# EAGLE design video_and_power (EAGLE 7.7.0)
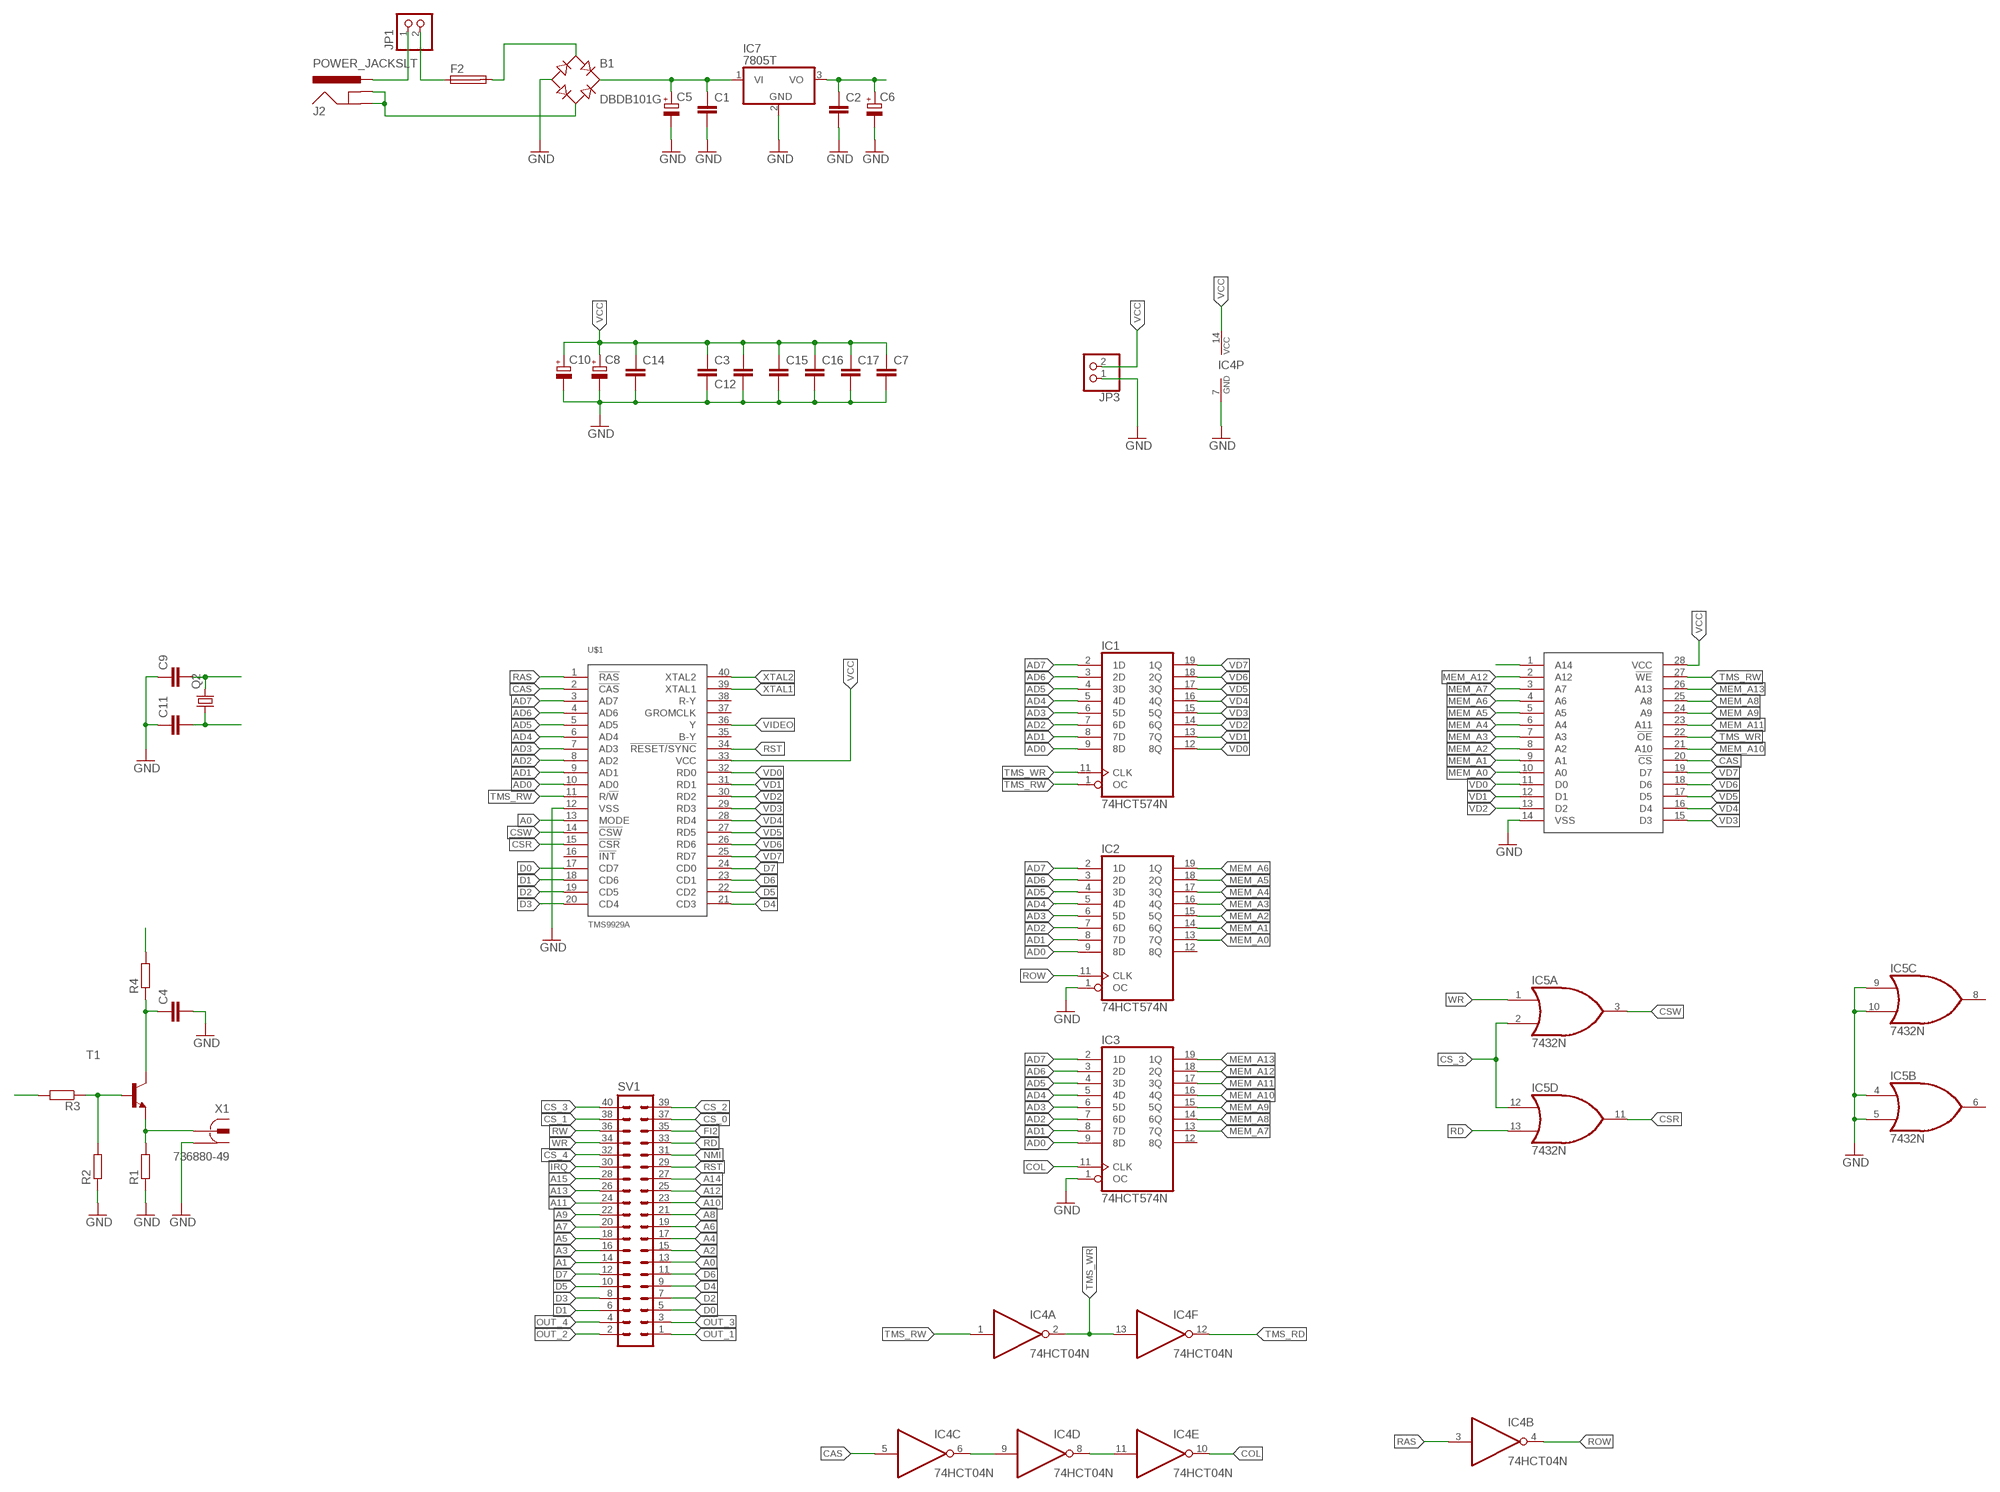
[diagram p0: schematic, sheet 1]

## Parts
B1  DBDB101G  [DB]
C1  C-EUC1206  [C1206]
C2  C-EUC1206  [C1206]
C3  C-EUC0603  [C0603]
C4  C-EUC0603  [C0603]
C5  CPOL-EUE5-10.5  [E5-10,5]
C6  CPOL-EUE5-10.5  [E5-10,5]
C7  C-EUC1206  [C1206]
C8  CPOL-EUE5-10.5  [E5-10,5]
C9  C-EUC0603  [C0603]
C10  CPOL-EUE5-10.5  [E5-10,5]
C11  C-EUC0603  [C0603]
C12  C-EUC0603  [C0603]
C14  C-EUC1206  [C1206]
C15  C-EUC1206  [C1206]
C16  C-EUC0603  [C0603]
C17  C-EUC0603  [C0603]
F2  SH22,5  [SH22,5]
IC1  74HCT574N  [DIL20]
IC2  74HCT574N  [DIL20]
IC3  74HCT574N  [DIL20]
IC4  74HCT04N  [DIL14]
IC5  7432N  [DIL14]
IC7  7805T  [TO220H]
J2  POWER_JACKSLT  [POWER_JACK_SLOT]
JP1  PINHD-1X2  [1X02]
JP3  PINHD-1X2/90  [1X02/90]
Q2  CRYSTALHC49S  [HC49/S]
R1  R-EU_R0603  [R0603]
R2  R-EU_R0603  [R0603]
R3  R-EU_0204/7  [0204/7]
R4  R-EU_R0805  [R0805]
SV1  ML40L  [ML40L]
T1  2N4401-NPN-TO92-EBC  [TO92-EBC]
U$1  TMS9929A  [DIL40]
U$2  62256  [DIL28-6]
X1  736880-49  [736880-49]

## Nets
A0: SV1.13 U$1.13(MODE)
A1: SV1.14
A2: SV1.15
A3: SV1.16
A4: SV1.17
A5: SV1.18
A6: SV1.19
A7: SV1.20
A8: SV1.21
A9: SV1.22
A10: SV1.23
A11: SV1.24
A12: SV1.25
A13: SV1.26
A14: SV1.27
A15: SV1.28
AD0: IC1.9(8D) IC2.9(8D) IC3.9(8D) U$1.10(AD0)
AD1: IC1.8(7D) IC2.8(7D) IC3.8(7D) U$1.9(AD1)
AD2: IC1.7(6D) IC2.7(6D) IC3.7(6D) U$1.8(AD2)
AD3: IC1.6(5D) IC2.6(5D) IC3.6(5D) U$1.7(AD3)
AD4: IC1.5(4D) IC2.5(4D) IC3.5(4D) U$1.6(AD4)
AD5: IC1.4(3D) IC2.4(3D) IC3.4(3D) U$1.5(AD5)
AD6: IC1.3(2D) IC2.3(2D) IC3.3(2D) U$1.4(AD6)
AD7: IC1.2(1D) IC2.2(1D) IC3.2(1D) U$1.3(AD7)
CAS: IC4.5(C:I) U$1.2(!CAS) U$2.20(!CS)
COL: IC3.11(CLK) IC4.10(E:O)
CS_0: SV1.37
CS_1: SV1.38
CS_2: SV1.39
CS_3: IC5.2(A:I1) IC5.12(D:I0) SV1.40
CS_4: SV1.32
CSR: IC5.11(D:O) U$1.15(!CSR)
CSW: IC5.3(A:O) U$1.14(!CSW)
D0: SV1.5 U$1.17(CD7)
D1: SV1.6 U$1.18(CD6)
D2: SV1.7 U$1.19(CD5)
D3: SV1.8 U$1.20(CD4)
D4: SV1.9 U$1.21(CD3)
D5: SV1.10 U$1.22(CD2)
D6: SV1.11 U$1.23(CD1)
D7: SV1.12 U$1.24(CD0)
FI2: SV1.35
GND: B1.- C1.2 C2.2 C3.2 C4.2 C5.- C6.- C7.2 C8.- C9.1 C10.- C11.1 C12.1 C14.2 C15.2 C16.2 C17.2 IC2.1(OC) IC3.1(OC) IC4.7(P:GND) IC5.4(B:I0) IC5.5(B:I1) IC5.9(C:I0) IC5.10(C:I1) IC7.2(GND) JP3.1 R1.1 R2.1 U$1.12(VSS) U$2.14(VSS) X1.1 X1.1@1 X1.1@2
IRQ: SV1.30
MEM_A0: IC2.13(7Q) U$2.10(A0)
MEM_A1: IC2.14(6Q) U$2.9(A1)
MEM_A2: IC2.15(5Q) U$2.8(A2)
MEM_A3: IC2.16(4Q) U$2.7(A3)
MEM_A4: IC2.17(3Q) U$2.6(A4)
MEM_A5: IC2.18(2Q) U$2.5(A5)
MEM_A6: IC2.19(1Q) U$2.4(A6)
MEM_A7: IC3.13(7Q) U$2.3(A7)
MEM_A8: IC3.14(6Q) U$2.25(A8)
MEM_A9: IC3.15(5Q) U$2.24(A9)
MEM_A10: IC3.16(4Q) U$2.21(A10)
MEM_A11: IC3.17(3Q) U$2.23(A11)
MEM_A12: IC3.18(2Q) U$2.2(A12)
MEM_A13: IC3.19(1Q) U$2.26(A13)
N$1: IC4.6(C:O) IC4.9(D:I)
N$2: IC4.8(D:O) IC4.11(E:I)
N$3: B1.AC1 F2.2
N$8: J2.PWR JP1.1
N$9: R1.2 T1.E X1.2
N$10: R2.2 R3.1 T1.B
N$11: C4.1 R4.1 T1.C
N$12: B1.AC2 J2.GND@1(GNDBREAK) J2.GND@2(GND)
N$13: F2.1 JP1.2
N$14: B1.+ C1.1 C5.+ IC7.1(VI)
NMI: SV1.31
OUT_1: SV1.1
OUT_2: SV1.2
OUT_3: SV1.3 U$2.1(A14)
OUT_4: SV1.4
RAS: IC4.3(B:I) U$1.1(!RAS)
RD: IC5.13(D:I1) SV1.33
ROW: IC2.11(CLK) IC4.4(B:O)
RST: SV1.29 U$1.34(!RESET/SYNC)
RW: SV1.36
TMS_RD: IC4.12(F:O)
TMS_RW: IC1.1(OC) IC4.1(A:I) U$1.11(R/!W) U$2.27(!WE)
TMS_WR: IC1.11(CLK) IC4.2(A:O) IC4.13(F:I) U$2.22(!OE)
VCC: C2.1 C3.1 C6.+ C7.1 C8.+ C10.+ C12.2 C14.1 C15.1 C16.1 C17.1 IC4.14(P:VCC) IC7.3(VO) JP3.2 R4.2 U$1.33(VCC) U$2.28(VCC)
VD0: IC1.12(8Q) U$1.32(RD0) U$2.11(D0)
VD1: IC1.13(7Q) U$1.31(RD1) U$2.12(D1)
VD2: IC1.14(6Q) U$1.30(RD2) U$2.13(D2)
VD3: IC1.15(5Q) U$1.29(RD3) U$2.15(D3)
VD4: IC1.16(4Q) U$1.28(RD4) U$2.16(D4)
VD5: IC1.17(3Q) U$1.27(RD5) U$2.17(D5)
VD6: IC1.18(2Q) U$1.26(RD6) U$2.18(D6)
VD7: IC1.19(1Q) U$1.25(RD7) U$2.19(D7)
VIDEO: R3.2 U$1.36(Y)
WR: IC5.1(A:I0) SV1.34
XTAL1: C9.2 Q2.2 U$1.39(XTAL1)
XTAL2: C11.2 Q2.1 U$1.40(XTAL2)
Unconnected: IC2.12(8Q) IC3.12(8Q) IC5.6(B:O) IC5.8(C:O) U$1.16(!INT) U$1.35(B-Y) U$1.37(GROMCLK) U$1.38(R-Y)

## Power pins joined to a net without a drawn wire
GND: IC1.10(GND) IC2.10(GND) IC3.10(GND) IC5.7(P:GND)
VCC: IC1.20(VCC) IC2.20(VCC) IC3.20(VCC) IC5.14(P:VCC)

## Library data of the parts
B1 = rectifier:DB?*G: Single Phase 1.0 AMP Glass Passivated Bridge Rectifier Taiwan Semiconductor Co.,Ltd. - TSC Source: http://www.taiwansemi.com/TSCbig5/ezcatfiles/cust/img/img/db101g.pdf http://www.ts.com.tw/db/pictures/modules/PDT/PDT060207001/DBLS201G.pdf
C1-C4 C7 C9 C11 C12 C14-C17 = rcl:C-EU: CAPACITOR, European symbol
C5 C6 C8 C10 = rcl:CPOL-EU: POLARIZED CAPACITOR, European symbol
F2 = fuse:SH22,5: FUSE HOLDER grid 22,5 mm, OGN0031 8201, Schurter (Buerklin); MF: SCHURTER; MPN: 0031.8201; OC_FARNELL: 1162740; OC_NEWARK: 96F8317
IC1-IC3 = 74xx-eu:74*574: 8-bit D type FLIP FLOP bus driver
IC4 = 74xx-eu:74*04: Hex INVERTER
IC5 = 74xx-us:74*32: Quad 2-input OR gate
IC7 = linear:78*: Positive VOLTAGE REGULATOR Source: http://cache.national.com/ds/LM/LM78L05.pdf http://www.fairchildsemi.com/ds/LM/LM7805.pdf
J2 = SparkFun-Connectors:POWER_JACK: Power Jack This is the standard 5.5mm barrel jack for power. The PTH is the most common, proven, reliable, footprint. The Slot footprint only works if the mill layer is transmitted to the PCB fab house so be warned. Mating wall wart : TOL-00298 (and others); PROD_ID: PRT-00119
JP1 JP3 = pinhead:PINHD-1X2: PIN HEADER
Q2 = crystal:CRYSTAL: CRYSTAL; OC_FARNELL: 1667008; OC_NEWARK: unknown
R1-R4 = rcl:R-EU_: RESISTOR, European symbol
SV1 = con-harting-ml:ML40: HARTING; OC_FARNELL: unknown; OC_NEWARK: unknown
T1 = transistor-neu-to92:*-NPN-: NPN Transistror
U$1 = mw:TMS9929A
U$2 = memory-sram:62256
X1 = con-conrad:736880-49: Cinch Connector ( RCA Jack ) Cinch-Einbaukupplung 90º 72345 Vernickelt BKL Electronic Source: Conrad <http://www.conrad.de/ce/de/product/736880>

## Board
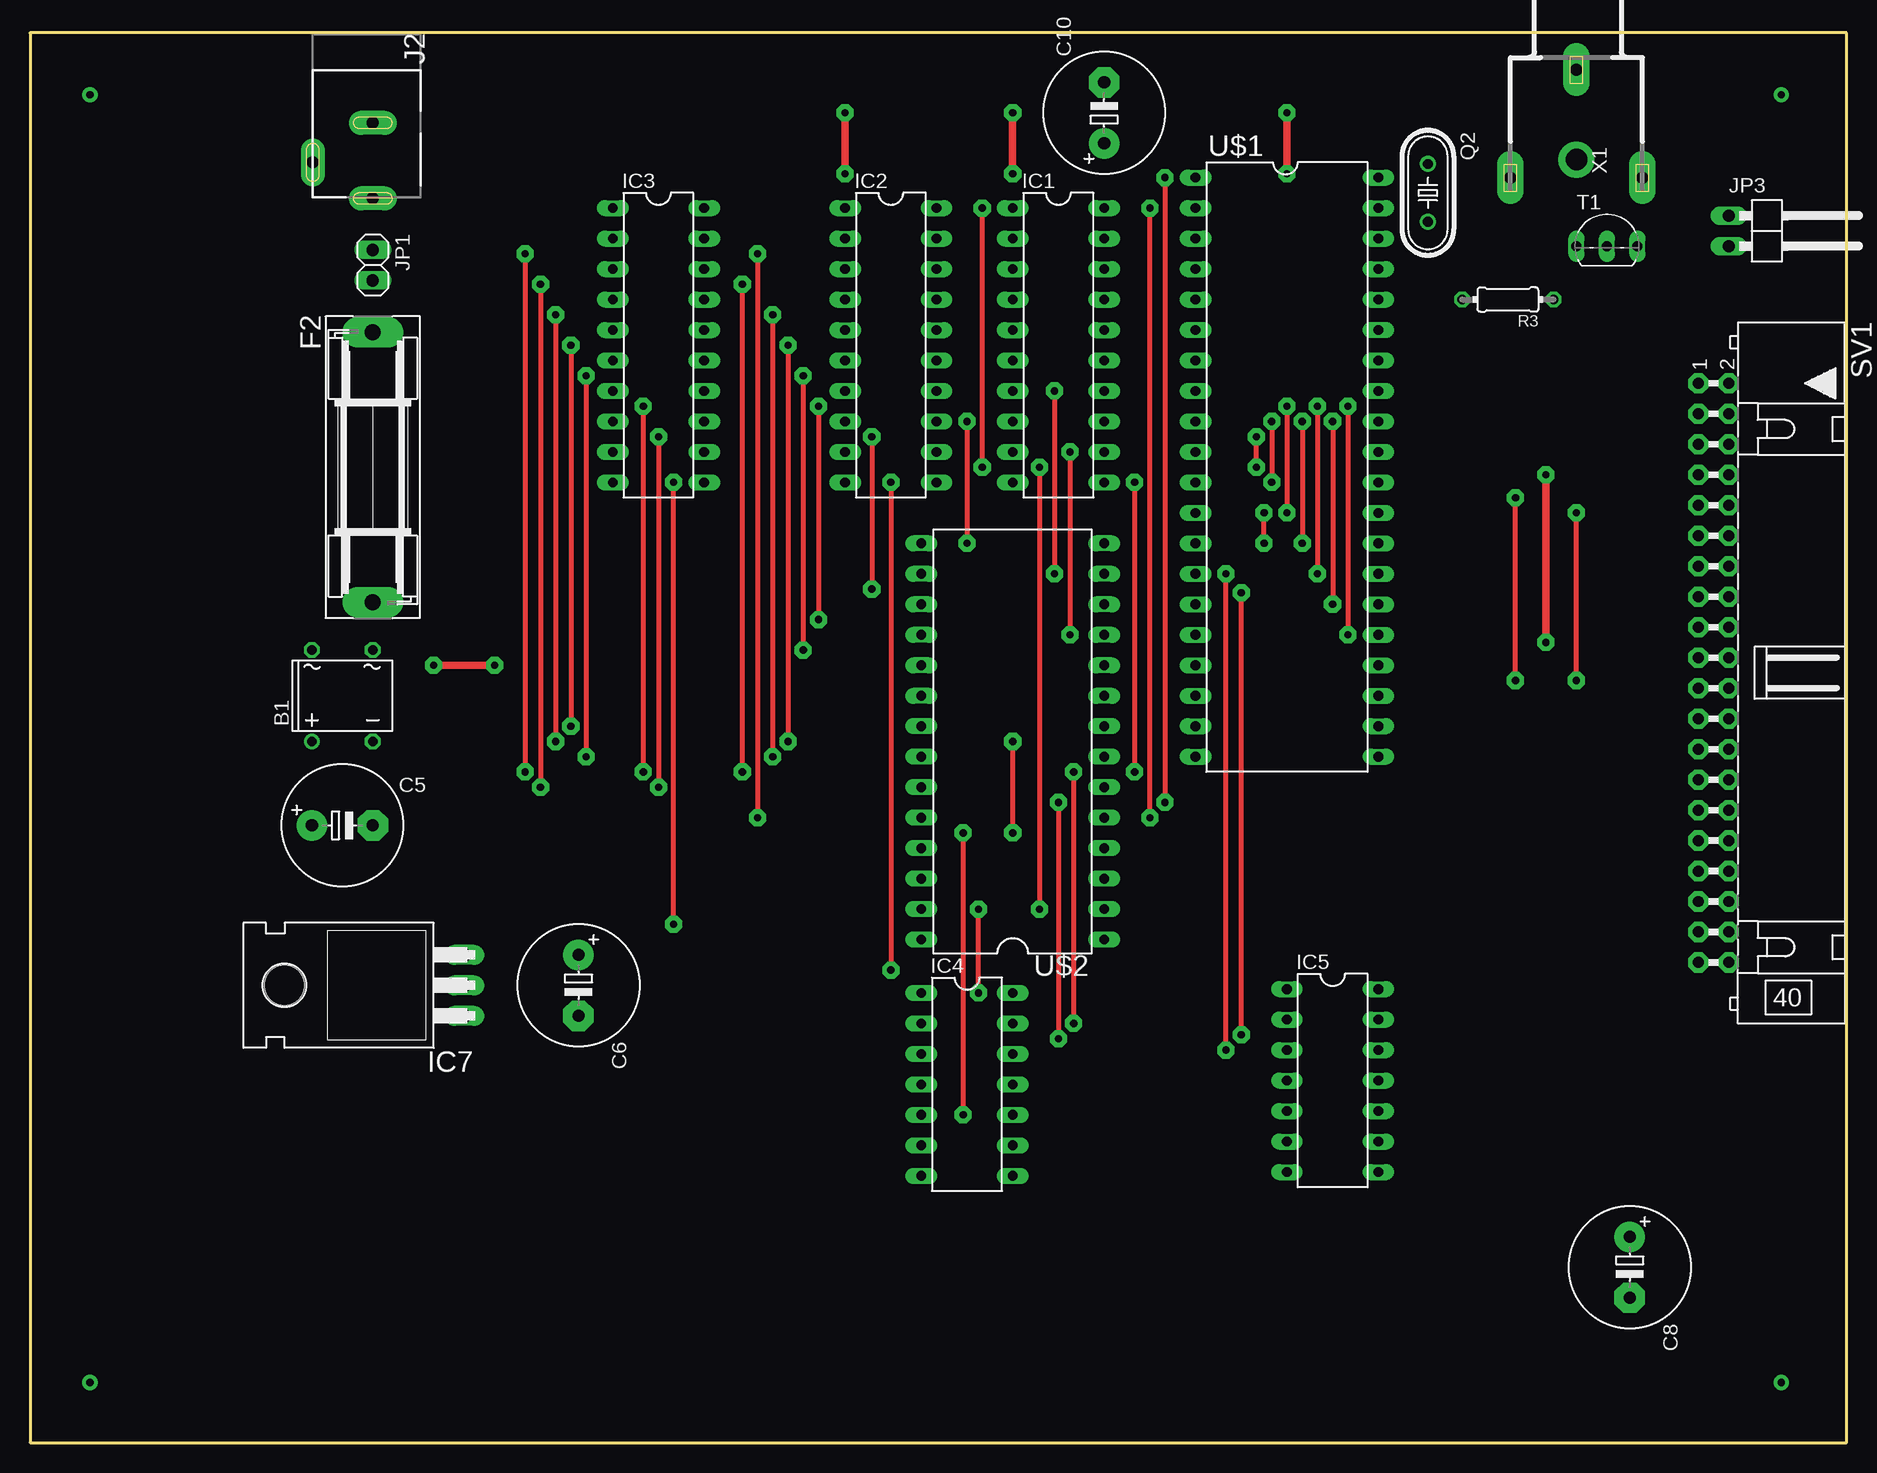
[diagram p1: board, top side]
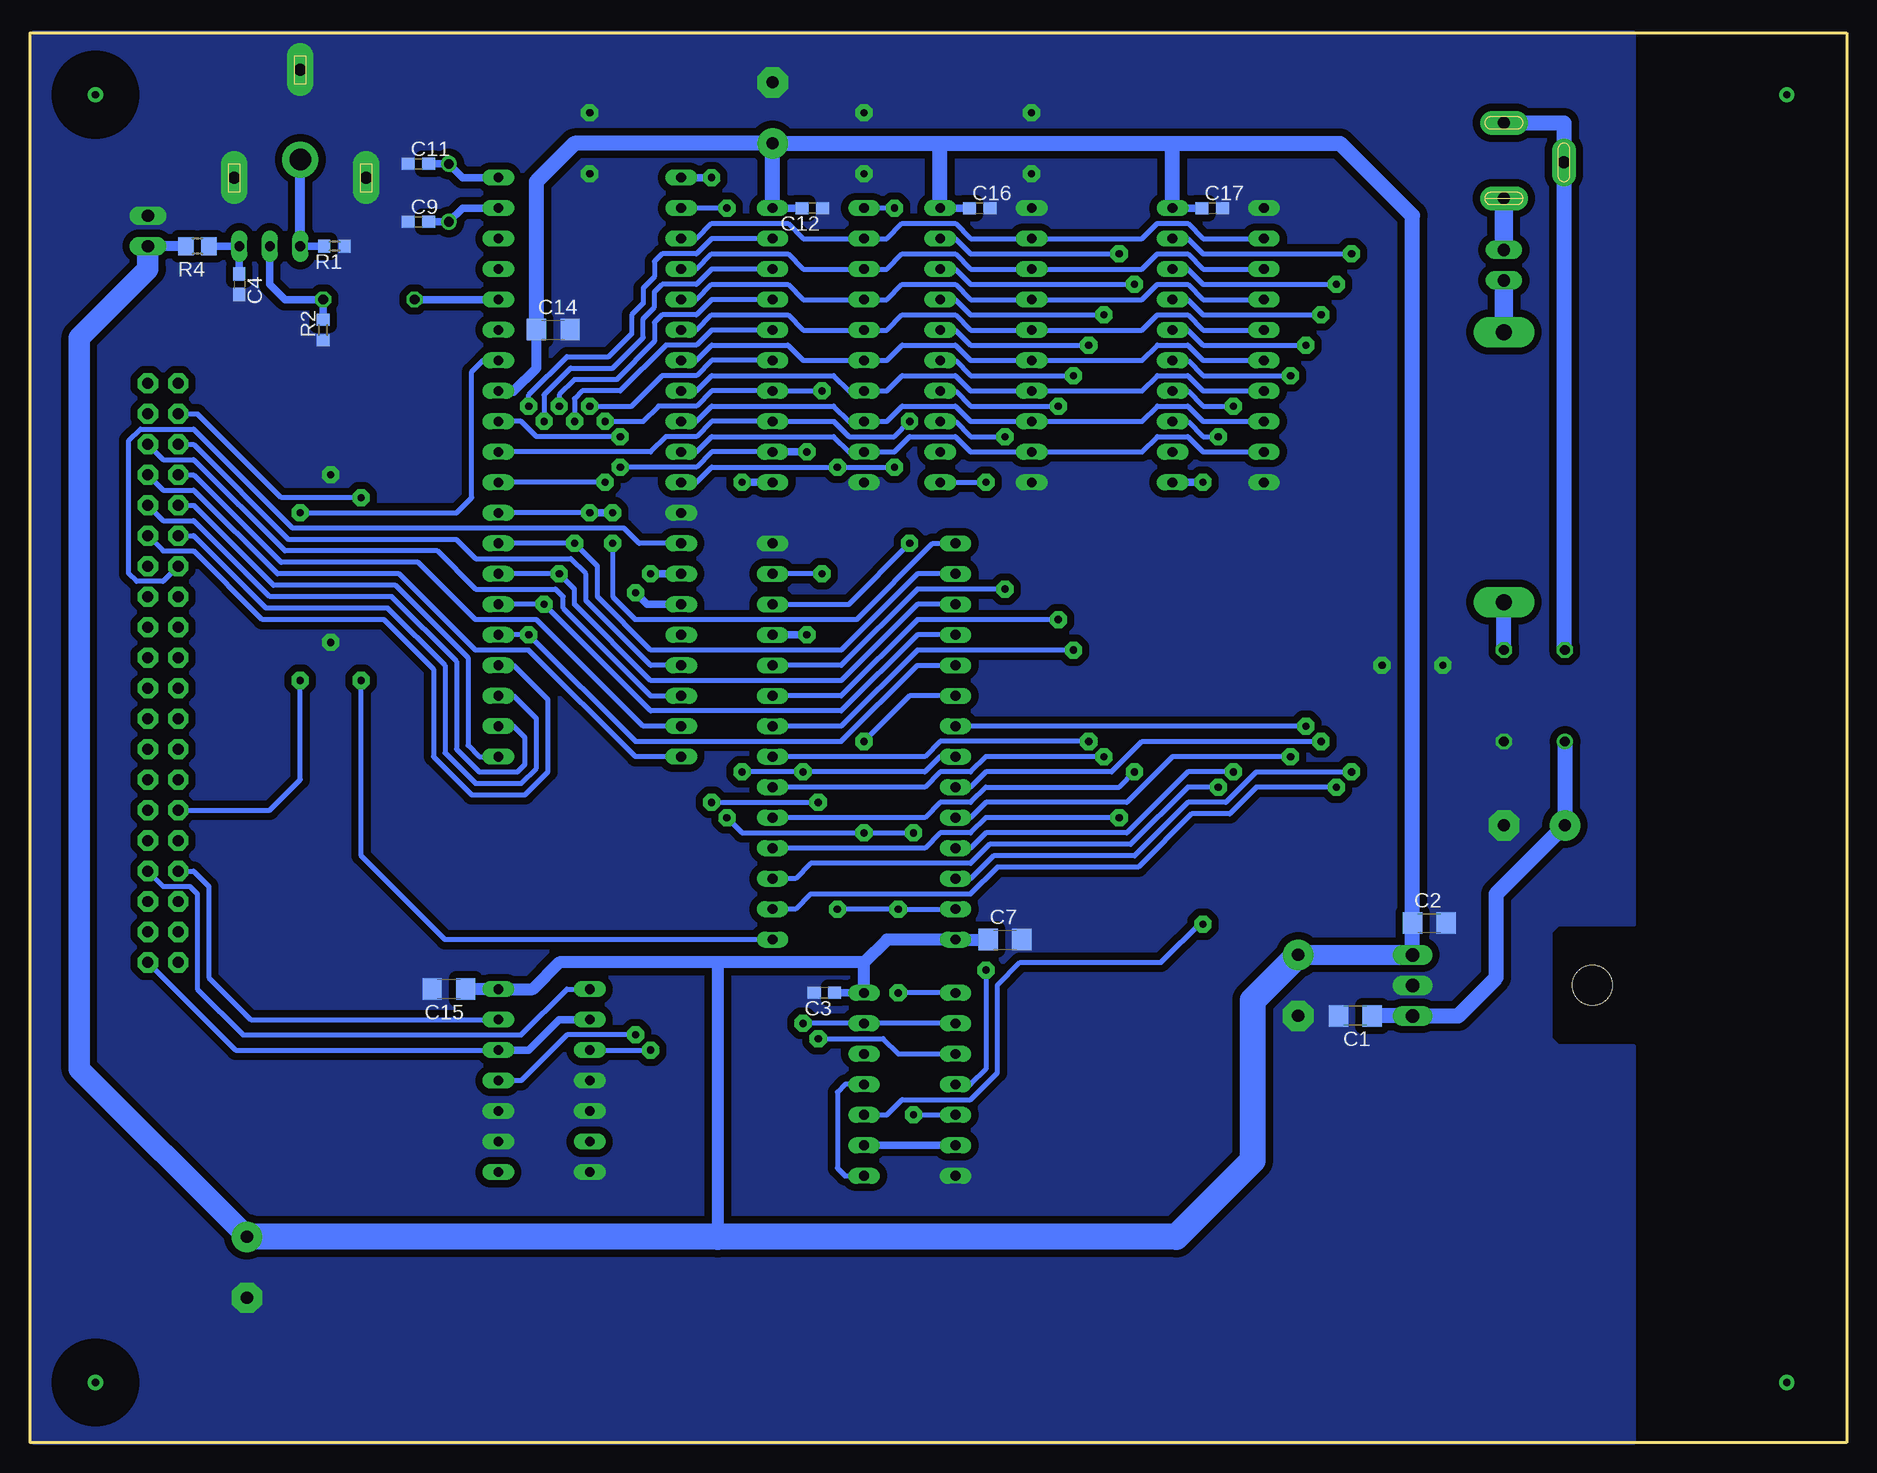
[diagram p2: board, bottom side, seen from below]

Size 151.44 x 117.47 mm. Coordinates in mm from the lower left corner, seen from the top.
Outline: 0,0 151.44,0 151.44,117.47 0,117.47 0,0
Copper layers (1*16): Top 0.035mm / dielectric 1.5mm / Bottom 0.035mm
Design rules "default *": minimum track width 10mil, minimum drill 24mil, track to track 8mil, track to pad 8mil, pad to pad 8mil, via to via 8mil, smd to smd 8mil, copper to edge 0mil, drill to drill 8mil, minimum pad ring 10mil, minimum via ring 8mil, stop-mask expansion 4mil, vias tented up to drill 0mil, thermal gap 10mil
bRestrict: area 2,2 to 8,8; area 2,109.3 to 8,115.4; area 142.9,2 to 149,8; area 142.9,109.3 to 149,115.4

### Footprints (pad centres in the part's own frame; a part is rotated, then mirrored left to right if it is on the bottom)
DB = drill 0.813: + -2.54,-3.81 | drill 0.813 octagon: - 2.54,-3.81; AC1 2.54,3.81; AC2 -2.54,3.81
C1206 = smd 1.6 x 1.8: 1 -1.4,0; 2 1.4,0
C0603 = smd 1.1 x 1: 1 -0.85,0; 2 0.85,0
E5-10,5 = drill 1.016 pad 2.54: + -2.54,0 | drill 1.016 pad 2.54 octagon: - 2.54,0
SH22,5 = drill 1.321 pad 2.54 long: 1 -11.252,0; 2 11.252,0
DIL20 = drill 0.813 long: 1 -11.43,-3.81; 2 -8.89,-3.81; 3 -6.35,-3.81; 4 -3.81,-3.81; 5 -1.27,-3.81; 6 1.27,-3.81; 7 3.81,-3.81; 8 6.35,-3.81; 9 8.89,-3.81; 10 11.43,-3.81; 11 11.43,3.81; 12 8.89,3.81; 13 6.35,3.81; 14 3.81,3.81; 15 1.27,3.81; 16 -1.27,3.81; 17 -3.81,3.81; 18 -6.35,3.81; 19 -8.89,3.81; 20 -11.43,3.81
DIL14 = drill 0.813 long: 1 -7.62,-3.81; 2 -5.08,-3.81; 3 -2.54,-3.81; 4 0,-3.81; 5 2.54,-3.81; 6 5.08,-3.81; 7 7.62,-3.81; 8 7.62,3.81; 9 5.08,3.81; 10 2.54,3.81; 11 0,3.81; 12 -2.54,3.81; 13 -5.08,3.81; 14 -7.62,3.81
TO220H = drill 1.118 long: 1 -2.54,-10.16; 2 0,-10.16; 3 2.54,-10.16 | hole 3.302: 0,4.826
POWER_JACK_SLOT = drill 1 pad 2 long: GND@1 2.58,7.5; GND@2 7.58,10.8; PWR 2.58,13.8
1X02 = drill 1.016 long: 1 -1.27,0; 2 1.27,0
1X02/90 = drill 1.016 long: 1 -1.27,-3.81; 2 1.27,-3.81
HC49/S = drill 0.813: 1 -2.413,0; 2 2.413,0
R0603 = smd 1 x 1.1: 1 -0.85,0; 2 0.85,0
0204/7 = drill 0.813 octagon: 1 -3.81,0; 2 3.81,0
R0805 = smd 1.3 x 1.5: 1 -0.95,0; 2 0.95,0
ML40L = drill 0.914 pad 1.676 octagon: 1 -24.13,-1.27; 2 -24.13,1.27; 3 -21.59,-1.27; 4 -21.59,1.27; 5 -19.05,-1.27; 6 -19.05,1.27; 7 -16.51,-1.27; 8 -16.51,1.27; 9 -13.97,-1.27; 10 -13.97,1.27; 11 -11.43,-1.27; 12 -11.43,1.27; 13 -8.89,-1.27; 14 -8.89,1.27; 15 -6.35,-1.27; 16 -6.35,1.27; 17 -3.81,-1.27; 18 -3.81,1.27; 19 -1.27,-1.27; 20 -1.27,1.27; 21 1.27,-1.27; 22 1.27,1.27; 23 3.81,-1.27; 24 3.81,1.27; 25 6.35,-1.27; 26 6.35,1.27; 27 8.89,-1.27; 28 8.89,1.27; 29 11.43,-1.27; 30 11.43,1.27; 31 13.97,-1.27; 32 13.97,1.27; 33 16.51,-1.27; 34 16.51,1.27; 35 19.05,-1.27; 36 19.05,1.27; 37 21.59,-1.27; 38 21.59,1.27; 39 24.13,-1.27; 40 24.13,1.27
TO92-EBC = drill 0.813 long: B 0,-1.27; C 2.54,-1.27; E -2.54,-1.27
DIL40 = drill 0.813 long: 1 -24.13,-7.62; 2 -21.59,-7.62; 3 -19.05,-7.62; 4 -16.51,-7.62; 5 -13.97,-7.62; 6 -11.43,-7.62; 7 -8.89,-7.62; 8 -6.35,-7.62; 9 -3.81,-7.62; 10 -1.27,-7.62; 11 1.27,-7.62; 12 3.81,-7.62; 13 6.35,-7.62; 14 8.89,-7.62; 15 11.43,-7.62; 16 13.97,-7.62; 17 16.51,-7.62; 18 19.05,-7.62; 19 21.59,-7.62; 20 24.13,-7.62; 21 24.13,7.62; 22 21.59,7.62; 23 19.05,7.62; 24 16.51,7.62; 25 13.97,7.62; 26 11.43,7.62; 27 8.89,7.62; 28 6.35,7.62; 29 3.81,7.62; 30 1.27,7.62; 31 -1.27,7.62; 32 -3.81,7.62; 33 -6.35,7.62; 34 -8.89,7.62; 35 -11.43,7.62; 36 -13.97,7.62; 37 -16.51,7.62; 38 -19.05,7.62; 39 -21.59,7.62; 40 -24.13,7.62
DIL28-6 = drill 0.813 long: 1 -16.51,-7.62; 2 -13.97,-7.62; 3 -11.43,-7.62; 4 -8.89,-7.62; 5 -6.35,-7.62; 6 -3.81,-7.62; 7 -1.27,-7.62; 8 1.27,-7.62; 9 3.81,-7.62; 10 6.35,-7.62; 11 8.89,-7.62; 12 11.43,-7.62; 13 13.97,-7.62; 14 16.51,-7.62; 15 16.51,7.62; 16 13.97,7.62; 17 11.43,7.62; 18 8.89,7.62; 19 6.35,7.62; 20 3.81,7.62; 21 1.27,7.62; 22 -1.27,7.62; 23 -3.81,7.62; 24 -6.35,7.62; 25 -8.89,7.62; 26 -11.43,7.62; 27 -13.97,7.62; 28 -16.51,7.62
736880-49 = drill 1 pad 2.2 long: 1 -3.92,0; 1@1 5.08,-5.5; 1@2 5.08,5.5 | drill 1.8 pad 3: 2 3.58,0

### Placement (x,y rotation side)
B1  26.04,62.23 0 top
C1  40.96,35.56 180 bottom
C2  34.79,43.29 0 bottom
C3  85.22,37.47 180 bottom
C4  133.99,96.52 270 bottom
C5  26.04,51.44 0 top
C6  45.72,38.1 270 top
C7  70.17,41.91 0 bottom
C8  133.35,14.61 270 top
C9  119.06,101.73 0 bottom
C10  89.53,110.81 90 top
C11  119.06,106.55 0 bottom
C12  86.23,102.87 180 bottom
C14  107.82,92.74 0 bottom
C15  116.52,37.78 180 bottom
C16  72.26,102.87 0 bottom
C17  52.9,102.87 0 bottom
F2  28.57,81.28 270 top
IC1  85.72,91.44 270 top
IC2  71.75,91.44 270 top
IC3  52.39,91.44 270 top
IC4  78.11,29.84 270 top
IC5  108.58,30.16 270 top
IC7  26.04,38.1 90 top
J2  31.15,117.47 180 top
JP1  28.57,98.11 270 top
JP3  145.41,100.97 270 top
Q2  116.52,104.14 270 top
R1  126.05,99.69 180 bottom
R2  127,92.71 90 bottom
R3  123.19,95.25 180 top
R4  137.48,99.69 180 bottom
SV1  140.34,64.14 270 top
T1  131.44,100.97 0 top
U$1  104.78,81.28 270 top
U$2  81.92,58.42 90 top
X1  128.91,110.49 270 top

### Tracks (layer width: path | path; a pad name or v marks a point on that pad's centre or on a via)
A0
  Bottom 0.406: SV1.13 140.34,71.75 142.56,71.75 143.19,72.39 143.19,83.5 142.24,84.45 137.79,84.45 129.54,76.2 101.92,76.2 100.65,74.93 U$1.13
AD0
  Bottom 0.406: U$1.10 95.89,82.55 94.61,83.82 84.45,83.82 83.19,82.55 IC1.9 79.38,82.55 78.11,83.82 74.3,83.82 73.03,82.55 IC2.9 58.74,82.55 57.47,83.82 54.93,83.82 53.66,82.55 IC3.9
AD1
  Bottom 0.406: U$1.9 95.89,85.09 94.61,86.36 84.45,86.36 83.19,85.09 IC1.8 80.01,85.09 78.74,86.36 74.3,86.36 73.03,85.09 IC2.8 58.74,85.09 57.47,86.36 54.93,86.36 53.66,85.09 IC3.8
AD2
  Bottom 0.406: U$1.8 95.89,87.63 94.61,88.9 84.45,88.9 83.19,87.63 IC1.7 80.01,87.63 78.74,88.9 74.3,88.9 73.03,87.63 IC2.7 58.74,87.63 57.47,88.9 54.93,88.9 53.66,87.63 IC3.7
AD3
  Bottom 0.406: U$1.7 95.89,90.17 94.61,91.44 88.27,91.44 87,90.17 IC1.6 80.01,90.17 78.74,91.44 74.3,91.44 73.03,90.17 IC2.6 58.74,90.17 57.47,91.44 54.93,91.44 53.66,90.17 IC3.6
AD4
  Bottom 0.406: U$1.6 95.89,92.71 94.61,93.98 88.27,93.98 87,92.71 IC1.5 80.01,92.71 78.74,93.98 74.3,93.98 73.03,92.71 IC2.5 58.74,92.71 57.47,93.98 54.93,93.98 53.66,92.71 IC3.5
AD5
  Bottom 0.406: U$1.5 95.89,95.25 94.61,96.52 88.27,96.52 87,95.25 IC1.4 80.01,95.25 78.74,96.52 74.3,96.52 73.03,95.25 IC2.4 58.74,95.25 57.47,96.52 54.93,96.52 53.66,95.25 IC3.4
AD6
  Bottom 0.406: U$1.4 95.89,97.79 94.61,99.06 88.27,99.06 87,97.79 IC1.3 80.01,97.79 78.74,99.06 74.3,99.06 73.03,97.79 IC2.3 58.74,97.79 57.47,99.06 54.93,99.06 53.66,97.79 IC3.3
AD7
  Bottom 0.406: U$1.3 95.89,100.33 94.61,101.6 88.27,101.6 87,100.33 IC1.2 80.01,100.33 78.74,101.6 74.3,101.6 73.03,100.33 IC2.2 58.74,100.33 57.47,101.6 54.93,101.6 53.66,100.33 IC3.2
CAS  (via drill 0.6 pad 1.42)
  Top 0.406: v81.92,58.42 v81.92,50.8 | v93.34,52.07 v93.34,102.87 | v77.79,50.8 v77.79,27.3
  Bottom 0.406: v93.34,102.87 U$1.2 | U$2.20 78.11,62.23 v81.92,58.42 | v77.79,50.8 v81.92,50.8 92.08,50.8 v93.34,52.07 | v77.79,27.3 IC4.5
COL  (via drill 0.6 pad 1.42)
  Top 0.406: v53.66,43.18 v53.66,80.01
  Bottom 0.406: IC4.10 80.01,27.3 78.74,28.57 73.03,28.57 70.8,30.8 70.8,38.1 68.9,40.01 57.15,40.01 53.66,43.5 v53.66,43.18
  Bottom 0.61: v53.66,80.01 IC3.11
CS_3
  Bottom 0.406: IC5.12 134.3,32.7 SV1.40
  Bottom 0.61: IC5.12 109.86,32.7 107.31,35.24 IC5.2
CSR  (via drill 0.6 pad 1.42)
  Top 0.406: v100.97,33.97 v100.97,70.8
  Bottom 0.406: v100.97,33.97 106.68,33.97 110.49,30.16 IC5.11
  Bottom 0.61: U$1.15 100.01,69.85 v100.97,70.8
CSW  (via drill 0.6 pad 1.42)
  Top 0.406: v99.69,32.7 v99.69,72.39
  Bottom 0.406: IC5.3 v99.69,32.7
  Bottom 0.61: v99.69,72.39 U$1.14
D0
  Bottom 0.406: SV1.5 137.79,83.19 129.86,75.25 115.89,75.25 114.3,73.66 106.36,73.66 105.09,72.39 105.09,70.17 99.69,64.77 U$1.17
D1
  Bottom 0.406: SV1.6 140.34,81.92 137.79,81.92 130.18,74.3 117.47,74.3 114.3,71.12 107.63,71.12 107,70.48 107,69.53 99.69,62.23 U$1.18
D2
  Bottom 0.406: SV1.7 137.79,80.64 130.49,73.34 119.06,73.34 114.3,68.58 109.22,68.58 100.33,59.69 U$1.19
D3
  Bottom 0.406: SV1.8 140.34,79.38 137.79,79.38 130.81,72.39 120.65,72.39 114.3,66.04 109.86,66.04 100.97,57.15 U$1.20
D4
  Bottom 0.406: SV1.9 137.79,78.11 131.13,71.44 120.97,71.44 114.94,65.41 114.94,58.1 113.98,57.15 U$1.21
D5
  Bottom 0.406: SV1.10 140.34,76.83 137.79,76.83 131.44,70.48 121.28,70.48 115.89,65.09 115.89,57.78 113.98,55.88 110.81,55.88 110.17,56.52 110.17,58.74 111.12,59.69 U$1.22
D6
  Bottom 0.406: SV1.11 137.79,75.56 131.76,69.53 121.6,69.53 116.84,64.77 116.84,57.47 114.3,54.93 110.49,54.93 109.22,56.2 109.22,60.33 111.12,62.23 U$1.23
D7
  Bottom 0.406: SV1.12 140.34,74.3 137.79,74.3 132.08,68.58 121.92,68.58 117.79,64.45 117.79,57.15 114.62,53.98 110.17,53.98 108.27,55.88 108.27,61.91 111.12,64.77 U$1.24
GND  (via drill 0.6 pad 1.42)
  Top 0.61: v104.78,110.81 v104.78,105.73 | v126.36,66.67 v126.36,80.64 | v38.73,64.77 v33.66,64.77 | v67.94,105.73 v67.94,110.81 | v81.92,105.73 v81.92,110.81
  pour Bottom (isolate 0.61, no thermals): 17.78,117.47 17.78,43.18 24.13,43.18 24.77,42.55 24.77,33.66 24.13,33.02 17.78,33.02 17.78,0 151.13,0 151.13,117.47
MEM_A0  (via drill 0.6 pad 1.42)
  Top 0.406: v70.17,83.82 v70.17,71.12
  Bottom 0.406: IC2.13 74.3,85.09 73.03,83.82 v70.17,83.82 | v70.17,71.12 77.47,71.12 83.82,64.77 U$2.10
MEM_A1  (via drill 0.6 pad 1.42)
  Top 0.406: v65.72,86.36 v65.72,68.58
  Bottom 0.406: IC2.14 74.3,87.63 73.03,86.36 v65.72,86.36 | v65.72,68.58 77.47,68.58 83.82,62.23 U$2.9
MEM_A2  (via drill 0.6 pad 1.42)
  Top 0.406: v64.45,88.9 v64.45,66.04
  Bottom 0.406: IC2.15 74.3,90.17 73.03,88.9 v64.45,88.9 | v64.45,66.04 77.47,66.04 83.82,59.69 U$2.8
MEM_A3  (via drill 0.6 pad 1.42)
  Top 0.406: v63.18,91.44 v63.18,58.42
  Bottom 0.406: IC2.16 74.3,92.71 73.03,91.44 v63.18,91.44 | v63.18,58.42 75.56,58.42 76.83,57.15 U$2.7
MEM_A4  (via drill 0.6 pad 1.42)
  Top 0.406: v61.91,93.98 v61.91,57.15
  Bottom 0.406: IC2.17 74.3,95.25 73.03,93.98 v61.91,93.98 | U$2.6 76.83,54.61 75.56,55.88 73.03,55.88 71.75,57.15 v61.91,57.15
MEM_A5  (via drill 0.6 pad 1.42)
  Top 0.406: v59.37,96.52 v59.37,55.88
  Bottom 0.406: IC2.18 74.3,97.79 73.03,96.52 v59.37,96.52 | U$2.5 76.83,52.07 75.56,53.34 73.03,53.34 71.75,54.61 60.64,54.61 v59.37,55.88
MEM_A6  (via drill 0.6 pad 1.42)
  Top 0.406: v60.64,99.06 v60.64,52.07
  Bottom 0.406: IC2.19 74.3,100.33 73.03,99.06 v60.64,99.06 | U$2.4 76.83,49.53 75.56,50.8 73.03,50.8 71.75,52.07 v60.64,52.07
MEM_A7  (via drill 0.6 pad 1.42)
  Top 0.406: v52.39,83.82 v52.39,54.61
  Bottom 0.406: IC3.13 54.93,85.09 53.66,83.82 v52.39,83.82 | U$2.3 87.63,46.99 86.36,48.26 73.03,48.26 71.44,49.85 59.69,49.85 54.93,54.61 v52.39,54.61
MEM_A8  (via drill 0.6 pad 1.42)
  Top 0.406: v51.12,86.36 v51.12,55.88
  Bottom 0.406: IC3.14 54.93,87.63 53.66,86.36 v51.12,86.36 | U$2.25 73.03,49.53 71.75,50.8 60.01,50.8 54.93,55.88 v51.12,55.88
MEM_A9  (via drill 0.6 pad 1.42)
  Top 0.406: v46.35,88.9 v46.35,57.15
  Bottom 0.406: IC3.15 54.93,90.17 53.66,88.9 v46.35,88.9 | U$2.24 73.03,52.07 71.75,53.34 60.01,53.34 56.2,57.15 v46.35,57.15
MEM_A10  (via drill 0.6 pad 1.42)
  Top 0.406: v45.09,91.44 v45.09,59.69
  Bottom 0.406: IC3.16 54.93,92.71 53.66,91.44 v45.09,91.44 | v45.09,59.69 U$2.21
MEM_A11  (via drill 0.6 pad 1.42)
  Top 0.406: v43.81,93.98 v43.81,58.42
  Bottom 0.406: IC3.17 54.93,95.25 53.66,93.98 v43.81,93.98 | v43.81,58.42 58.74,58.42 61.28,55.88 71.75,55.88 73.03,54.61 U$2.23
MEM_A12  (via drill 0.6 pad 1.42)
  Top 0.406: v42.55,96.52 v42.55,54.61
  Bottom 0.406: IC3.18 54.93,97.79 53.66,96.52 v42.55,96.52 | U$2.2 87.63,44.45 86.36,45.72 73.03,45.72 70.8,47.94 59.05,47.94 54.61,52.39 51.44,52.39 49.21,54.61 v42.55,54.61
MEM_A13  (via drill 0.6 pad 1.42)
  Top 0.406: v41.27,99.06 v41.27,55.88
  Bottom 0.406: IC3.19 54.93,100.33 53.66,99.06 v41.27,99.06 | v41.27,55.88 49.21,55.88 51.75,53.34 54.93,53.34 59.37,48.9 71.12,48.9 73.03,46.99 U$2.26
N$1
  Bottom 0.61: IC4.6 IC4.9
N$2
  Bottom 0.406: IC4.8 83.5,22.23 84.14,22.86 84.14,29.21 83.5,29.84 IC4.11
N$3
  Bottom 1.27: B1.AC1 F2.2
N$8
  Bottom 1.524: JP1.1 J2.PWR
N$9
  Bottom 0.61: R1.2 T1.E
  Bottom 0.813: T1.E X1.2
N$10
  Bottom 0.61: R2.2 R3.1 130.18,95.25 131.44,96.52 T1.B
N$11
  Bottom 0.61: C4.1 T1.C R4.1
  Bottom 0.813: T1.C
N$12
  Bottom 1.27: B1.AC2 23.56,66.11 J2.GND@2 23.56,109.97 J2.GND@1
N$13
  Bottom 1.524: JP1.2 F2.1
N$14
  Bottom 1.27: C1.1 IC7.1 32.38,35.56 29.21,38.73 29.21,45.72 C5.+ B1.+
N$23  (via drill 0.6 pad 1.27)
  other vias: 5,112.31
N$24  (via drill 0.6 pad 1.27)
  other vias: 145.97,5
N$25  (via drill 0.6 pad 1.27)
  other vias: 145.97,112.31
N$37  (via drill 0.6 pad 1.27)
  other vias: 5,5
OUT_3  (via drill 0.6 pad 1.42)
  Top 0.406: v123.83,63.5 v123.83,78.74
  Bottom 0.406: SV1.3 137.48,85.72 130.49,78.74 v123.83,78.74 | v123.83,63.5 123.83,48.9 116.84,41.91 U$2.1
RAS  (via drill 0.6 pad 1.42)
  Top 0.406: v94.61,105.41 v94.61,53.34 | v85.72,53.34 v85.72,33.66
  Bottom 0.406: v94.61,53.34 v85.72,53.34 | v85.72,33.66 80.33,33.66 79.06,32.38 IC4.3
  Bottom 0.61: U$1.1 v94.61,105.41
RD
  Bottom 0.406: SV1.33 137.79,47.62 136.53,46.35 136.53,38.73 133.03,35.24 IC5.13
ROW  (via drill 0.6 pad 1.42)
  Top 0.406: v71.75,80.01 v71.75,39.37
  Bottom 0.406: IC2.11 v71.75,80.01 | v71.75,39.37 71.75,31.11 73.03,29.84 IC4.4
RST  (via drill 0.6 pad 1.42)
  Top 0.406: v128.91,63.5 v128.91,77.47
  Bottom 0.406: v128.91,77.47 115.89,77.47 114.62,78.74 114.62,89.22 113.67,90.17 U$1.34 | SV1.29 131.44,52.7 128.91,55.24 v128.91,63.5
TMS_RW  (via drill 0.6 pad 1.42)
  Top 0.406: v79.38,81.28 v79.38,102.87 | v84.14,81.28 v84.14,44.45 | v79.06,37.47 v79.06,44.45
  Bottom 0.406: U$1.11 95.89,80.01 94.61,81.28 v79.38,81.28 v84.14,81.28 | v79.38,102.87 IC1.1 | IC4.1 v79.06,37.47 | v84.14,44.45 v79.06,44.45 U$2.27
TMS_WR  (via drill 0.6 pad 1.42)
  Top 0.406: v87,55.88 v87,34.92 | v92.08,80.01 v92.08,55.88
  Bottom 0.406: U$2.22 75.56,57.15 76.83,55.88 v87,55.88 v92.08,55.88 | IC4.2 IC4.13 v87,34.92
  Bottom 0.61: IC1.11 v92.08,80.01
VCC
  Bottom 0.406: C14.1 109.22,92.71
  Bottom 0.61: IC2.20 C16.1 | IC1.20 C12.2 | IC3.20 C17.1 | IC4.14 C3.1 | 141.6,99.06 JP3.2
  Bottom 0.813: U$1.33 111.12,87.63 109.22,89.53 109.22,92.71 | R4.2 JP3.2
  Bottom 1.016: 94.11,40.01 94.11,17.14 | C7.1 U$2.28 80.01,41.91 81.92,40.01 | C15.1 IC5.14 109.54,37.78 107.31,40.01 94.11,40.01 | IC4.14 81.92,40.01 | 81.92,40.01 94.11,40.01
  Bottom 1.27: 109.22,92.71 109.22,105.09 106.05,108.27 C10.+ | IC7.3 C2.1 36.19,102.23 42.23,108.27 56.2,108.27 | C10.+ 75.56,108.27 | 75.56,108.27 56.2,108.27 | IC2.20 75.56,108.27 | IC3.20 56.2,108.27 | IC1.20 C10.+
  Bottom 1.676: C6.+ IC7.3
  Bottom 1.778: C8.+ 147.32,31.11 147.32,92.08 141.6,97.79 141.6,99.06
  Bottom 2.184: C8.+ 94.11,17.14 55.88,17.14 49.53,23.5 49.53,36.83 C6.+
VD0  (via drill 0.6 pad 1.42)
  Top 0.406: v102.23,81.28 v102.23,83.82 | v86.68,82.55 v86.68,67.31
  Bottom 0.406: IC1.12 94.61,82.55 95.89,81.28 v102.23,81.28 | U$1.32 110.49,85.09 109.22,83.82 v102.23,83.82
  Bottom 0.61: IC1.12 v86.68,82.55 | v86.68,67.31 U$2.11
VD1  (via drill 0.6 pad 1.42)
  Top 0.406: v78.11,85.09 v78.11,74.93
  Bottom 0.406: U$1.31 99.69,82.55 98.42,83.82 95.89,83.82 94.61,85.09 IC1.13 84.45,85.09 83.19,83.82 79.38,83.82 v78.11,85.09 | U$2.12 83.19,69.85 v78.11,74.93
VD2  (via drill 0.6 pad 1.42)
  Top 0.406: v103.5,85.09 v103.5,80.01 | v85.41,87.63 v85.41,72.39
  Bottom 0.406: v103.5,80.01 U$1.30 | v103.5,85.09 100.33,85.09 99.06,86.36 95.89,86.36 94.61,87.63 IC1.14 v85.41,87.63 | v85.41,72.39 U$2.13
VD3  (via drill 0.6 pad 1.42)
  Top 0.406: v104.78,86.36 v104.78,77.47 | v102.87,74.93 v102.87,77.47
  Bottom 0.406: IC1.15 94.61,90.17 95.89,88.9 98.74,88.9 101.28,86.36 v104.78,86.36 | 111.12,77.47 U$1.29 v104.78,77.47 | U$2.15 76.2,74.93 82.55,68.58 100.97,68.58 102.87,70.48 v102.87,74.93
  Bottom 0.61: v102.87,77.47 v104.78,77.47
VD4  (via drill 0.6 pad 1.42)
  Top 0.406: v106.05,85.09 v106.05,74.93
  Bottom 0.406: IC1.16 94.61,92.71 95.89,91.44 98.42,91.44 102.23,87.63 105.41,87.63 106.05,87 v106.05,85.09 | 111.12,74.93 U$1.28 v106.05,74.93 104.14,73.03 104.14,70.48 99.69,66.04 83.82,66.04 77.47,72.39 U$2.16
VD5  (via drill 0.6 pad 1.42)
  Top 0.406: v107.31,86.36 v107.31,72.39
  Bottom 0.406: IC1.17 94.61,95.25 95.89,93.98 98.74,93.98 99.38,93.34 99.38,91.76 102.55,88.58 106.05,88.58 107.31,87.31 v107.31,86.36 | U$1.27 v107.31,72.39 106.05,71.12 106.05,69.85 99.69,63.5 83.82,63.5 77.47,69.85 U$2.17
VD6  (via drill 0.6 pad 1.42)
  Top 0.406: v108.58,85.09 v108.58,69.85
  Bottom 0.406: IC1.18 94.61,97.79 95.89,96.52 98.74,96.52 99.38,95.89 99.38,94.61 100.33,93.66 100.33,92.08 102.87,89.53 106.36,89.53 108.58,87.31 v108.58,85.09 | U$1.26 v108.58,69.85 99.69,60.96 83.82,60.96 77.47,67.31 U$2.18
VD7  (via drill 0.6 pad 1.42)
  Top 0.406: v109.86,86.36 v109.86,67.31
  Bottom 0.406: IC1.19 94.61,100.33 95.89,99.06 98.74,99.06 99.38,98.42 99.38,97.16 100.33,96.2 100.33,94.93 101.28,93.98 101.28,92.39 103.19,90.49 106.68,90.49 109.86,87.31 v109.86,86.36 | U$1.25 v109.86,67.31 100.97,58.42 83.82,58.42 77.47,64.77 U$2.19
VIDEO
  Bottom 0.61: U$1.36 R3.2
WR
  Bottom 0.406: SV1.34 140.34,46.35 138.11,46.35 137.48,45.72 137.48,37.78 133.67,33.97 110.49,33.97 106.68,37.78 IC5.1
XTAL1
  Bottom 0.61: U$1.39 115.38,102.87 Q2.2 C9.2
XTAL2
  Bottom 0.61: U$1.40 115.38,105.41 Q2.1 C11.2